# EAGLE design MineralFire-0.4-OLED-inprogress (EAGLE 9.1.3)

## Sheet 1 of 3: Main function
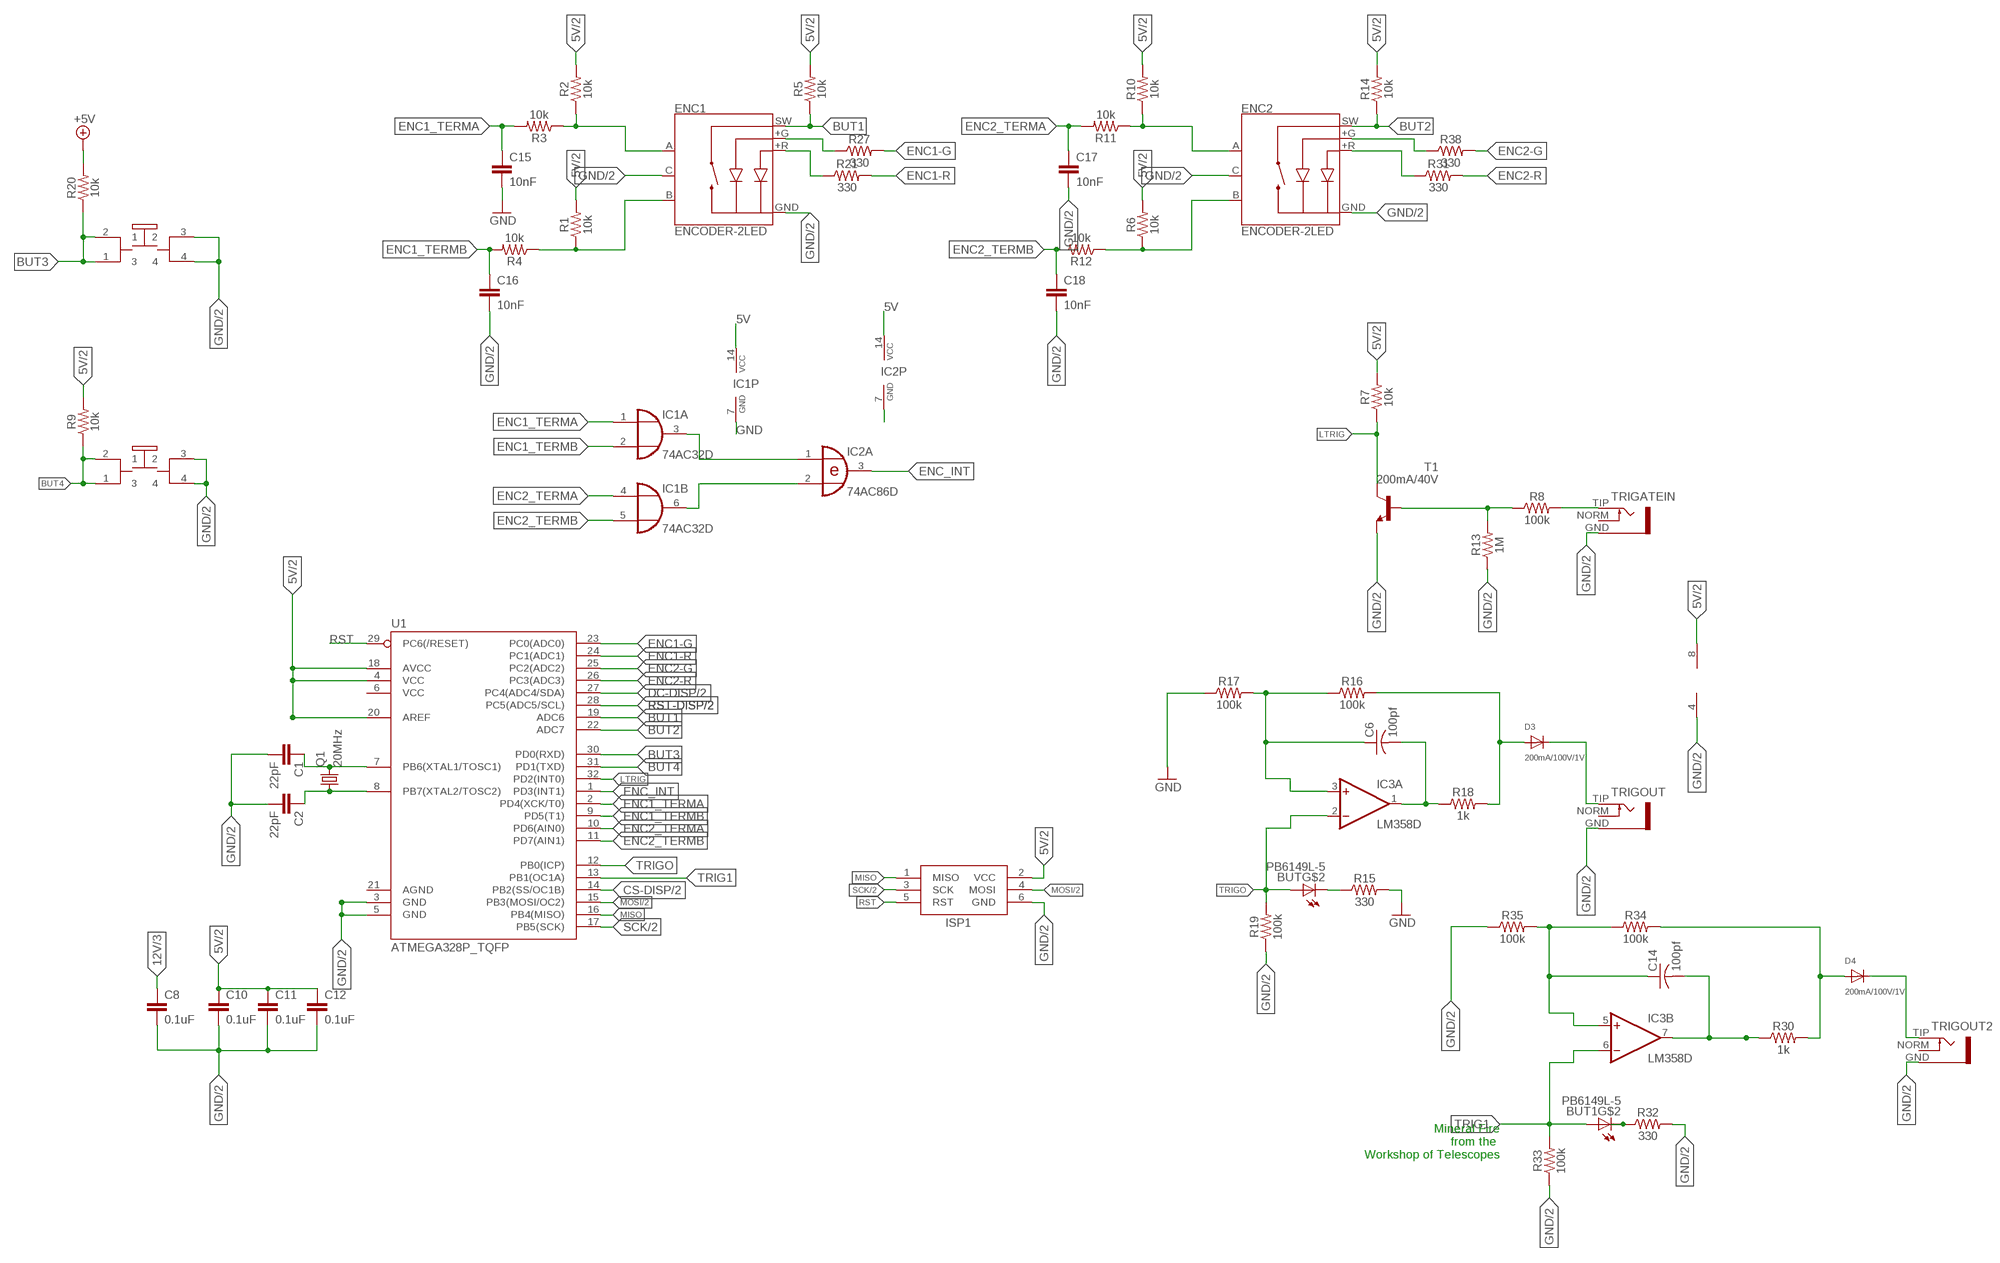
[diagram p0: schematic, sheet 1]

### Parts
BUT  PB6149L-5  [PB6149L]
BUT1  PB6149L-5  [PB6149L]
C1  22pF  22PF-0603-50V-5%  [0603]
C2  22pF  22PF-0603-50V-5%  [0603]
C6  100pf  C-USC0805K  [C0805K]
C8  0.1uF  0.1UF-0603-100V-10%  [0603]
C10  0.1uF  0.1UF-0603-100V-10%  [0603]
C11  0.1uF  0.1UF-0603-100V-10%  [0603]
C12  0.1uF  0.1UF-0603-100V-10%  [0603]
C14  100pf  C-USC0805K  [C0805K]
C15  10nF  10NF-0603-50V-10%  [0603]
C16  10nF  10NF-0603-50V-10%  [0603]
C17  10nF  10NF-0603-50V-10%  [0603]
C18  10nF  10NF-0603-50V-10%  [0603]
D3  200mA/100V/1V  DIODESMA  [SMADIODE]
D4  200mA/100V/1V  DIODESMA  [SMADIODE]
ENC1  ENCODER-2LED  [ENCODER_LED_2]
ENC2  ENCODER-2LED  [ENCODER_LED_2]
IC1  74AC32D  [SO14]
IC2  74AC86D  [SO14]
IC3  LM358D  [SO08]
ISP1  AVRISP-6  [AVRISP]
Q1  20MHz  CRYSTALHC49UP  [HC49UP]
R1  10k  10KOHM-0603-1/10W-1%  [0603]
R2  10k  10KOHM-0603-1/10W-1%  [0603]
R3  10k  10KOHM-0603-1/10W-1%  [0603]
R4  10k  10KOHM-0603-1/10W-1%  [0603]
R5  10k  10KOHM-0603-1/10W-1%  [0603]
R6  10k  10KOHM-0603-1/10W-1%  [0603]
R7  10k  10KOHM-0603-1/10W-1%  [0603]
R8  100k  100KOHM-0603-1/10W-1%  [0603]
R9  10k  10KOHM-0603-1/10W-1%  [0603]
R10  10k  10KOHM-0603-1/10W-1%  [0603]
R11  10k  10KOHM-0603-1/10W-1%  [0603]
R12  10k  10KOHM-0603-1/10W-1%  [0603]
R13  1M  1MOHM-0603-1/4W-5%  [0603]
R14  10k  10KOHM-0603-1/10W-1%  [0603]
R15  330  330OHM-0603-1/10W-1%  [0603]
R16  100k  100KOHM-0603-1/10W-1%  [0603]
R17  100k  100KOHM-0603-1/10W-1%  [0603]
R18  1k  1KOHM-0603-1/10W-1%  [0603]
R19  100k  100KOHM-0603-1/10W-1%  [0603]
R20  10k  10KOHM-0603-1/10W-1%  [0603]
R21  330  330OHM-0603-1/10W-1%  [0603]
R27  330  330OHM-0603-1/10W-1%  [0603]
R30  1k  1KOHM-0603-1/10W-1%  [0603]
R31  330  330OHM-0603-1/10W-1%  [0603]
R32  330  330OHM-0603-1/10W-1%  [0603]
R33  100k  100KOHM-0603-1/10W-1%  [0603]
R34  100k  100KOHM-0603-1/10W-1%  [0603]
R35  100k  100KOHM-0603-1/10W-1%  [0603]
R38  330  330OHM-0603-1/10W-1%  [0603]
T1  200mA/40V  MMBT3904LT1-NPN-SOT23-BEC  [SOT23-BEC]
TRIGATEIN  S_JACK  [S_JACK]
TRIGOUT  S_JACK  [S_JACK]
TRIGOUT2  S_JACK  [S_JACK]
U1  ATMEGA328P_TQFP  [TQFP32-08]

### Nets
5V: C10.1 C11.1 C12.1 IC1.14(P:VCC) IC2.14(P:VCC) IC3.8(P:V+) ISP1.2(VCC) R1.2 R2.2 R5.2 R6.2 R7.2 R9.2 R10.2 R14.2 U1.4(VCC) U1.18(AVCC) U1.20(AREF) ; also sheet 2,3
12V [12V]: C8.1 ; also sheet 3
+5V [Power]: R20.2
BUT1 [Power]: ENC1.SW R5.1 U1.19(ADC6)
BUT2 [Power]: ENC2.SW R14.1 U1.22(ADC7)
BUT3: BUT1.1 BUT1.2 R20.1 U1.30(PD0(RXD))
BUT4: BUT.1 BUT.2 R9.1 U1.31(PD1(TXD))
CS-DISP: U1.14(PB2(SS/OC1B)) ; also sheet 2
DC-DISP: U1.27(PC4(ADC4/SDA)) ; also sheet 2
ENC1-G: R27.2 U1.23(PC0(ADC0))
ENC1-R: R21.2 U1.24(PC1(ADC1))
ENC1_TERMA: C15.1 IC1.1(A:I0) R3.2 U1.2(PD4(XCK/T0))
ENC1_TERMB: C16.1 IC1.2(A:I1) R4.2 U1.9(PD5(T1))
ENC2-G: R38.2 U1.25(PC2(ADC2))
ENC2-R: R31.2 U1.26(PC3(ADC3))
ENC2_TERMA: C17.1 IC1.4(B:I0) R11.2 U1.10(PD6(AIN0))
ENC2_TERMB: C18.1 IC1.5(B:I1) R12.2 U1.11(PD7(AIN1))
ENC_INT: IC2.3(A:O) U1.1(PD3(INT1))
GND [Power]: BUT1.3 BUT1.4 BUT.3 BUT.4 C1.2 C2.2 C8.2 C10.2 C11.2 C12.2 C15.2 C16.2 C17.2 C18.2 ENC1.C ENC1.GND(-) ENC2.C ENC2.GND(-) IC1.7(P:GND) IC2.7(P:GND) IC3.4(P:V-) ISP1.6(GND) R13.1 R15.2 R17.1 R19.1 R32.2 R33.1 R35.1 T1.E TRIGATEIN.GND TRIGOUT2.GND TRIGOUT.GND U1.3(GND) U1.5(GND) ; also sheet 2,3
LTRIG: R7.1 T1.C U1.32(PD2(INT0))
MISO: ISP1.1(MISO) U1.16(PB4(MISO))
MOSI: ISP1.4(MOSI) U1.15(PB3(MOSI/OC2)) ; also sheet 2
N$1: C1.1 Q1.2 U1.7(PB6(XTAL1/TOSC1))
N$2: C2.1 Q1.1 U1.8(PB7(XTAL2/TOSC2))
N$3: ENC1.+R R21.1
N$4: IC1.3(A:O) IC2.1(A:I0)
N$5: IC1.6(B:O) IC2.2(A:I1)
N$6: ENC1.A R2.1 R3.1
N$12: ENC1.B R1.1 R4.1
N$15: R8.1 R13.2 T1.B
N$18: R8.2 TRIGATEIN.TIP
N$19: C14.2 IC3.7(B:OUT) R30.1
N$21: BUT1.K(C) R32.1
N$22: D4.A R30.2 R34.2
N$23: D4.C TRIGOUT2.TIP
N$24: C14.1 IC3.5(B:+IN) R34.1 R35.2
N$27: ENC2.A R10.1 R11.1
N$28: ENC2.B R6.1 R12.1
N$30: ENC1.+G R27.1
N$31: BUT.K(C) R15.1
N$32: C6.1 IC3.3(A:+IN) R16.1 R17.2
N$33: C6.2 IC3.1(A:OUT) R18.1
N$34: D3.A R16.2 R18.2
N$35: ENC2.+G R38.1
N$36: ENC2.+R R31.1
N$74: D3.C TRIGOUT.TIP
RST: ISP1.5(RST) U1.29(PC6(/RESET))
RST-DISP: U1.28(PC5(ADC5/SCL)) ; also sheet 2
SCK: ISP1.3(SCK) U1.17(PB5(SCK)) ; also sheet 2
TRIG1: BUT1.A IC3.6(B:-IN) R33.2 U1.13(PB1(OC1A))
TRIGO: BUT.A IC3.2(A:-IN) R19.2 U1.12(PB0(ICP))
Unconnected: IC1.8(C:O) IC1.9(C:I0) IC1.10(C:I1) IC1.11(D:O) IC1.12(D:I0) IC1.13(D:I1) IC2.4(B:I0) IC2.5(B:I1) IC2.6(B:O) IC2.8(C:O) IC2.9(C:I0) IC2.10(C:I1) IC2.11(D:O) IC2.12(D:I0) IC2.13(D:I1) TRIGATEIN.NORM TRIGOUT2.NORM TRIGOUT.NORM U1.6(VCC) U1.21(AGND)

### Notes on the sheet
- Mineral Fire
  from the 
  Workshop of Telescopes

## Sheet 2 of 3: Display
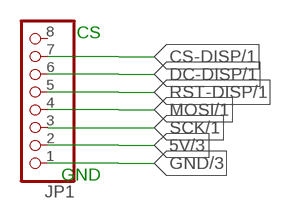
[diagram p1: schematic, sheet 2]

### Parts
JP1  MICROBUILDER_HEADER-1X8ROUND  [MICROBUILDER_1X08_ROUND]

### Nets
5V: JP1.2 ; also sheet 1,3
CS-DISP: JP1.7 ; also sheet 1
DC-DISP: JP1.6 ; also sheet 1
GND [Power]: JP1.1 ; also sheet 1,3
MOSI: JP1.4 ; also sheet 1
RST-DISP: JP1.5 ; also sheet 1
SCK: JP1.3 ; also sheet 1
Unconnected: JP1.8

### Notes on the sheet
- CS
- GND

## Sheet 3 of 3: Power
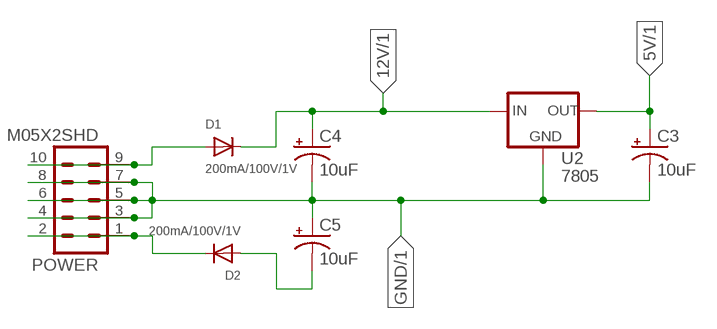
[diagram p2: schematic, sheet 3]

### Parts
C3  10uF  CPOL-US153CLV-0505  [153CLV-0505]
C4  10uF  CPOL-US153CLV-0505  [153CLV-0505]
C5  10uF  CPOL-US153CLV-0505  [153CLV-0505]
D1  200mA/100V/1V  DIODESMA  [SMADIODE]
D2  200mA/100V/1V  DIODESMA  [SMADIODE]
POWER  M05X2SHD  [2X5-SHROUDED]
U2  7805  V-REG  [V-REG]

### Nets
5V: C3.+ U2.3(OUT) ; also sheet 1,2
12V [12V]: C4.+ D1.C U2.1(IN) ; also sheet 1
GND [Power]: C3.- C4.- C5.+ POWER.3 POWER.4 POWER.5 POWER.6 POWER.7 POWER.8 U2.4(GND) ; also sheet 1,2
N$9: D1.A POWER.9 POWER.10
N$10: D2.C POWER.1 POWER.2
N$38 [Power]: C5.- D2.A

## Library data of the parts
BUT BUT1 = INSTRUO:PB6149L-5
C1 C2 = SparkFun-Capacitors:22PF: 22pF ceramic capacitors A capacitor is a passive two-terminal electrical component used to store electrical energy temporarily in an electric field.; PROD_ID: CAP-07876
C3-C5 = rcl:CPOL-US: POLARIZED CAPACITOR, American symbol; SPICEPREFIX: C
C6 C14 = rcl:C-US: CAPACITOR, American symbol; SPICEPREFIX: C
C8 C10-C12 = SparkFun-Capacitors:0.1UF: 0.1µF ceramic capacitors A capacitor is a passive two-terminal electrical component used to store electrical energy temporarily in an electric field.; PROD_ID: CAP-08390
C15-C18 = SparkFun-Capacitors:10NF: 0.01uF/10nF/10,000pF ceramic capacitors A capacitor is a passive two-terminal electrical component used to store electrical energy temporarily in an electric field. CAP-09321; PROD_ID: CAP-00867
D1-D4 = adafruit:DIODE: Diode SMADIODE - SMA Surface Mount Package 20V 1A Schottky Diode Digikey: 641-1014-6-ND DO-1N4148 - Through Hole Small Current Diode SOD-123 20V 1 A (.5mV Vf) Schottky Diode - Digikey: MBRX120TPMSCT-ND SOD-323 10V 570mA (.38mV Vf, 3ns) Schottky Diode - Digikey: ZLLS410CT-ND SOD-523 30V 30mA Schottky Diode (RB751S-40TE61) - Digikey: RB751S-40TE61CT-ND SOT23-R/W - SOT23 Package (R = Solder Paste/Reflow Ovens, W = Hand-Soldering) BAT54Film 40V 300mA - Digikey: 497-7162-1-ND
ENC1 ENC2 = SparkFun-Switches:ENCODER-2LED: Illuminated Rotary Encoder w/ 2 LEDs Rotary encoders rotate similarly to potentiometers, but they’re different from potentiometers in that an encoder has full rotation without limits. They output gray code so that you can tell how much and in which direction the encoder has been turned. This encoder has a red/green LED built-in, which shines through the encoder shaft. SparkFun Products Rotary Encoder - Illuminated (Red/Green) <https://www.sparkfun.com/products/10596> (COM-10596) SparkFun Rotary Encoder Breakout - Illuminated (RG/RGB) <https://www.sparkfun.com/products/11722> (BOB-11722); PROD_ID: COMP-11113; SF_SKU: COM-10596
IC1 = 74xx-eu:74*32: Quad 2-input OR gate
IC2 = 74xx-eu:74*86: Quad 2-input EXCLUSIVE-OR (XOR) gate
IC3 = linear:LM358: OP AMP also LM158; LM258; LM2904 Source: http://cache.national.com/ds/LM/LM158.pdf
ISP1 = adafruit:AVRISP: AVR ISP HEADER Standard 6 pin header for AVR programming
JP1 = Adafruit_1.3_128x64_OLED:MICROBUILDER_HEADER-1X8: PIN HEADER
POWER = SparkFun-Connectors:M05X2: Header 5x2 Standard 10-pin dual row 0.1" header. Commonly used with AVR-ISP. Use with Spark Fun Electronics SKU: PRT-00778
Q1 = adafruit:CRYSTAL: CRYSTAL; OC_FARNELL: unknown; OC_NEWARK: unknown
R1-R7 R9-R12 R14 R20 = SparkFun-Resistors:10KOHM: 10kΩ resistor A resistor is a passive two-terminal electrical component that implements electrical resistance as a circuit element. Resistors act to reduce current flow, and, at the same time, act to lower voltage levels within circuits. - Wikipedia; PROD_ID: RES-00824
R8 R16 R17 R19 R33-R35 = SparkFun-Resistors:100KOHM: 100kΩ resistor A resistor is a passive two-terminal electrical component that implements electrical resistance as a circuit element. Resistors act to reduce current flow, and, at the same time, act to lower voltage levels within circuits. - Wikipedia; PROD_ID: RES-07828
R13 = SparkFun-Resistors:1MOHM: 1MΩ resistor A resistor is a passive two-terminal electrical component that implements electrical resistance as a circuit element. Resistors act to reduce current flow, and, at the same time, act to lower voltage levels within circuits. - Wikipedia; PROD_ID: RES-07868
R15 R21 R27 R31 R32 R38 = SparkFun-Resistors:330OHM: 330Ω resistor A resistor is a passive two-terminal electrical component that implements electrical resistance as a circuit element. Resistors act to reduce current flow, and, at the same time, act to lower voltage levels within circuits. - Wikipedia; PROD_ID: RES-00818
R18 R30 = SparkFun-Resistors:1KOHM: 1kΩ resistor A resistor is a passive two-terminal electrical component that implements electrical resistance as a circuit element. Resistors act to reduce current flow, and, at the same time, act to lower voltage levels within circuits. - Wikipedia; PROD_ID: RES-07856
T1 = transistor:*-NPN-: NPN Transistror BF959 corrected 2008.03.06
TRIGATEIN TRIGOUT TRIGOUT2 = INSTRUO:S_JACK
U1 = SparkFun-IC-Microcontroller:ATMEGA328P_TQFP: Popular 328P in QFP Storefront component: ATmega328 - TQFP <https://www.sparkfun.com/products/13448> (COM-13448) Datasheet <http://www.sparkfun.com/datasheets/Components/SMD/ATMega328.pdf> SparkFun Products SparkFun RedBoard - Programmed with Arduino <https://www.sparkfun.com/products/12757> (DEV-12757) Arduino Pro Mini 328 - 5V/16MHz <https://www.sparkfun.com/products/11113> (DEV-11113) Arduino Pro Mini 328 - 3.3V/8MHz <https://www.sparkfun.com/products/11114> (DEV-11114) SparkFun OpenLog <https://www.sparkfun.com/products/13712> (DEV-13712) SparkFun MicroView - OLED Arduino Module <https://www.sparkfun.com/products/12923> (DEV-12923) SparkFun Digital Sandbox <https://www.sparkfun.com/products/12651> (DEV-12651) SparkFun PicoBoard <https://www.sparkfun.com/products/11888> (WIG-11888) Arduino Fio <https://www.sparkfun.com/products/10116> (DEV-10116) LilyPad Arduino 328 Main Board <https://www.sparkfun.com/products/13342> (DEV-13342) SparkFun RedStick <https://www.sparkfun.com/products/13741> (DEV-13741) LilyPad MP3 <https://www.sparkfun.com/products/11013> (DEV-11013) LilyPad Arduino SimpleSnap <https://www.sparkfun.com/products/10941> (DEV-10941) SparkFun Stepoko <https://www.sparkfun.com/products/13899> (ROB-13899) SparkFun Geiger Counter <https://www.sparkfun.com/products/11345> (SEN-11345) SparkFun EL Sequencer <https://www.sparkfun.com/products/12781> (COM-12781) Arduino Pro 328 - 5V/16MHz <https://www.sparkfun.com/products/10915> (DEV-10915) CryptoCape <https://www.sparkfun.com/products/12773> (DEV-12773) SparkFun IR Thermometer Evaluation Board - MLX90614 <https://www.sparkfun.com/products/10740> (SEN-10740) SparkFun RedBot Mainboard <https://www.sparkfun.com/products/12097> (ROB-12097) Arduino Pro 328 - 3.3V/8MHz <https://www.sparkfun.com/products/10914> (DEV-10914) SparkFun Block for Intel® Edison - Arduino <https://www.sparkfun.com/products/13036> (DEV-13036) SparkFun Simon Says - Surface Mount Soldering Kit <https://www.sparkfun.com/products/10935> (KIT-10935) SparkFun 7-Segment Serial Display - Red <https://www.sparkfun.com/products/11441> (COM-11441) SparkFun 7-Segment Serial Display - White <https://www.sparkfun.com/products/11629> (COM-11629) SparkFun 7-Segment Serial Display - Yellow <https://www.sparkfun.com/products/11443> (COM-11443) SparkFun 7-Segment Serial Display - Kelly Green <https://www.sparkfun.com/products/11440> (COM-11440) SparkFun 7-Segment Serial Display - Blue <https://www.sparkfun.com/products/11442> (COM-11442) SparkFun OpenSegment Serial Display - 20mm (Blue) <https://www.sparkfun.com/products/11647> (COM-11647) SparkFun OpenSegment Serial Display - 20mm (Green) <https://www.sparkfun.com/products/11646> (COM-11646) SparkFun OpenSegment Serial Display - 20mm (White) <https://www.sparkfun.com/products/11648> (COM-11648) SparkFun OpenSegment Serial Display - 20mm (Red) <https://www.sparkfun.com/products/11644> (COM-11644) SparkFun OpenSegment Serial Display - 20mm (Yellow) <https://www.sparkfun.com/products/11645> (COM-11645) SparkFun OpenSegment Shield <https://www.sparkfun.com/products/13190> (DEV-13190); PROD_ID: IC-09069
U2 = INSTRUO:V-REG

## Net classes
1 Power: width 0.35 mm
2 12V: width 0.6 mm

## Board
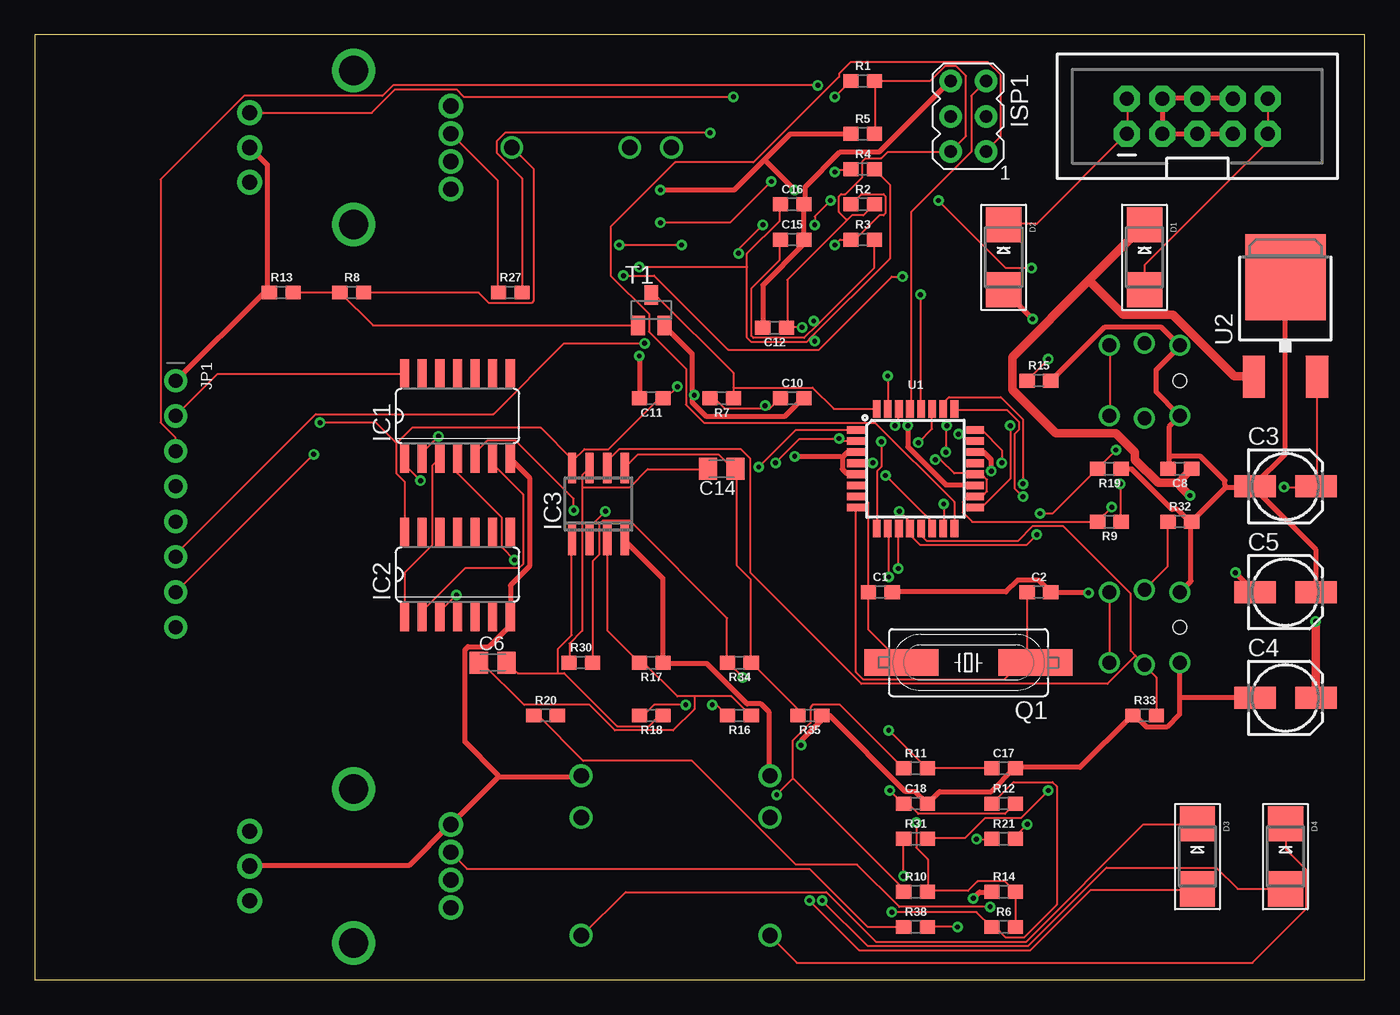
[diagram p3: board, top side]
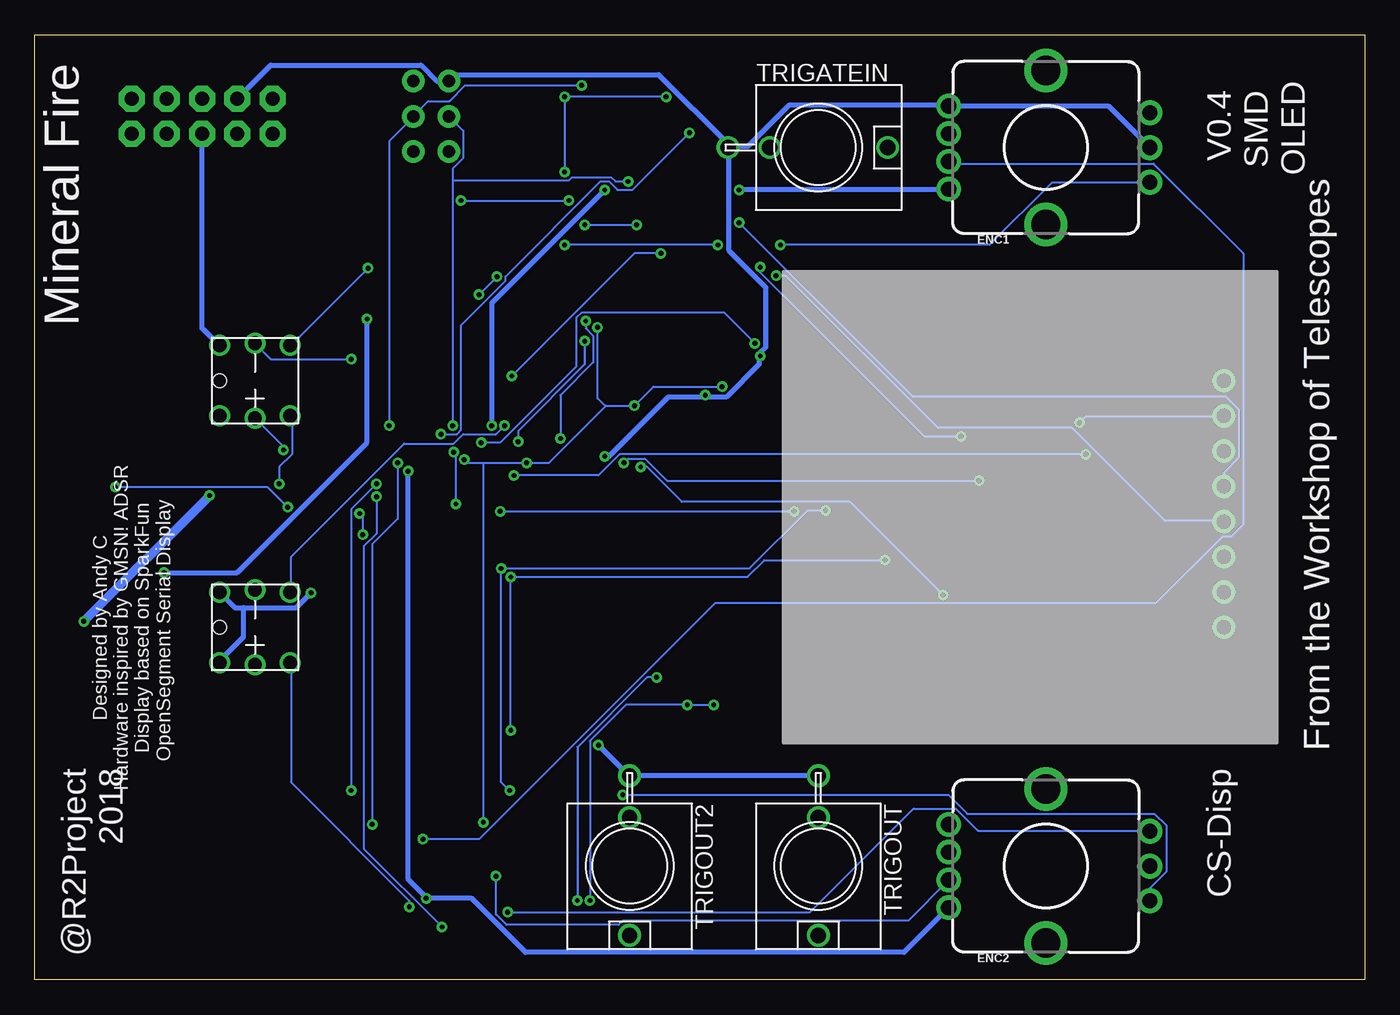
[diagram p4: board, bottom side, seen from below]

Size 95.89 x 68.11 mm. Coordinates in mm from the lower left corner, seen from the top.
Outline: 0,0 95.89,0 95.89,68.11 0,68.11 0,0
Copper layers (1*16): Top 0.035mm / dielectric 1.5mm / Bottom 0.035mm
Design rules "default": minimum track width 6mil, minimum drill 0.35mm, track to track 6mil, track to pad 6mil, pad to pad 6mil, via to via 6mil, smd to smd 6mil, copper to edge 40mil, drill to drill 6mil, minimum pad ring 10mil, minimum via ring 8mil, stop-mask expansion 4mil, vias tented up to drill 0mil, thermal gap 10mil

### Footprints (pad centres in the part's own frame; a part is rotated, then mirrored left to right if it is on the bottom)
PB6149L = drill 1: 1 2.54,-2.54; 2 2.54,2.54; 3 -2.54,-2.54; 4 -2.54,2.54; A 0,-2.7; K 0,2.7 | hole 1: -2.54,0
0603 = smd 1.1 x 1: 1 -0.85,0; 2 0.85,0
153CLV-0505 = smd 3 x 1.6: + 2.2,0; - -2.2,0
C0805K = smd 1.3 x 1.6: 1 -1,0; 2 1,0
SMADIODE = smd 2.54 x 2.54: A 2.349,0; C -2.349,0
ENCODER_LED_2 = drill 1.1 pad 1.778: +G 1,7; +R -1,7; GND 3,7; SW -3,7 | drill 1.1 pad 1.8: A -2.5,-7.5; B 2.5,-7.5; C 0,-7.5 | drill 2.1: P$1 -5.55,0; P$2 5.55,0
SO14 = smd 0.66 x 2.032: 1 -3.81,-3.073; 2 -2.54,-3.073; 3 -1.27,-3.073; 4 0,-3.073; 5 1.27,-3.073; 6 2.54,-3.073; 7 3.81,-3.073; 8 3.81,3.073; 9 2.54,3.073; 10 1.27,3.073; 11 0,3.073; 12 -1.27,3.073; 13 -2.54,3.073; 14 -3.81,3.073
SO08 = smd 0.6 x 2.2: 1 -1.905,-2.6; 2 -0.635,-2.6; 3 0.635,-2.6; 4 1.905,-2.6; 5 1.905,2.6; 6 0.635,2.6; 7 -0.635,2.6; 8 -1.905,2.6
AVRISP = drill 0.9 pad 1.626: 1 -1.27,2.54; 2 1.27,2.54; 3 -1.27,0; 4 1.27,0; 5 -1.27,-2.54; 6 1.27,-2.54
MICROBUILDER_1X08_ROUND = drill 1 pad 1.676: 1 -8.89,0; 2 -6.35,0; 3 -3.81,0; 4 -1.27,0; 5 1.27,0; 6 3.81,0; 7 6.35,0; 8 8.89,0
2X5-SHROUDED = drill 1.016 pad 1.88 octagon: 1 -1.27,5.08; 2 1.27,5.08; 3 -1.27,2.54; 4 1.27,2.54; 5 -1.27,0; 6 1.27,0; 7 -1.27,-2.54; 8 1.27,-2.54; 9 -1.27,-5.08; 10 1.27,-5.08
HC49UP = smd 5.334 x 1.93: 1 -4.826,0; 2 4.826,0
SOT23-BEC = smd 1 x 1.4: B -0.95,-1.1; C 0,1.1; E 0.95,-1.1
S_JACK = drill 1.1: GND 0,-6.5; NORM 0,-3.5; TIP 0,5
TQFP32-08 = smd 1.27 x 0.559: 1 -4.293,2.8; 2 -4.293,2; 3 -4.293,1.2; 4 -4.293,0.4; 5 -4.293,-0.4; 6 -4.293,-1.2; 7 -4.293,-2; 8 -4.293,-2.8; 17 4.293,-2.8; 18 4.293,-2; 19 4.293,-1.2; 20 4.293,-0.4; 21 4.293,0.4; 22 4.293,1.2; 23 4.293,2; 24 4.293,2.8 | smd 0.559 x 1.27: 9 -2.8,-4.293; 10 -2,-4.293; 11 -1.2,-4.293; 12 -0.4,-4.293; 13 0.4,-4.293; 14 1.2,-4.293; 15 2,-4.293; 16 2.8,-4.293; 25 2.8,4.293; 26 2,4.293; 27 1.2,4.293; 28 0.4,4.293; 29 -0.4,4.293; 30 -1.2,4.293; 31 -2,4.293; 32 -2.8,4.293
V-REG = smd 1.6 x 3: 1 -2.28,-4.8; 3 2.28,-4.8 | smd 5.8 x 6.2: 4 0,2.38

### Placement (x,y rotation side)
BUT  80.01,43.18 0 bottom
BUT1  80.01,25.4 0 bottom
C1  60.96,27.94 0 top
C2  72.39,27.94 0 top
C3  90.17,35.56 0 top
C4  90.17,20.32 0 top
C5  90.17,27.94 0 top
C6  33.02,22.86 0 top
C8  82.55,36.83 180 top
C10  54.61,41.91 0 top
C11  44.45,41.91 180 top
C12  53.34,46.99 180 top
C14  49.53,36.83 180 top
C15  54.61,53.34 0 top
C16  54.61,55.88 0 top
C17  69.85,15.24 0 top
C18  63.5,12.7 0 top
D1  80.01,52.07 270 top
D2  69.85,52.07 270 top
D3  83.82,8.89 270 top
D4  90.17,8.89 270 top
ENC1  23,59.98 90 bottom
ENC2  23,8.2 90 bottom
IC1  30.48,40.64 0 top
IC2  30.48,29.21 0 top
IC3  40.64,34.29 0 top
ISP1  67.31,62.23 180 top
JP1  10.16,34.29 270 top
POWER  83.82,62.23 90 top
Q1  67.31,22.86 180 top
R1  59.69,64.77 0 top
R2  59.69,55.88 0 top
R3  59.69,53.34 0 top
R4  59.69,58.42 0 top
R5  59.69,60.96 0 top
R6  69.85,3.81 0 top
R7  49.53,41.91 180 top
R8  22.86,49.53 0 top
R9  77.47,33.02 180 top
R10  63.5,6.35 0 top
R11  63.5,15.24 0 top
R12  69.85,12.7 0 top
R13  17.78,49.53 0 top
R14  69.85,6.35 0 top
R15  72.39,43.18 0 top
R16  50.8,19.05 180 top
R17  44.45,22.86 180 top
R18  44.45,19.05 180 top
R19  77.47,36.83 180 top
R20  36.83,19.05 0 top
R21  69.85,10.16 0 top
R27  34.29,49.53 0 top
R30  39.37,22.86 0 top
R31  63.5,10.16 0 top
R32  82.55,33.02 0 top
R33  80.01,19.05 0 top
R34  50.8,22.86 180 top
R35  55.88,19.05 180 top
R38  63.5,3.81 0 top
T1  44.45,48.26 0 top
TRIGATEIN  39.4,59.98 270 bottom
TRIGOUT  39.4,8.2 180 bottom
TRIGOUT2  53,8.2 180 bottom
U1  63.5,36.83 0 top
U2  90.17,48.26 0 top

### Tracks (layer width: path | path; a pad name or v marks a point on that pad's centre or on a via)
5V  (via drill 0.35)
  Top 0.152: IC1.14 26.67,43.66 13.18,43.66 10.21,40.69 JP1.2 | 26.1,38.67 27.2,39.78 36.5,39.78 38.79,37.49 IC3.8 38.79,36.96 38.79,37.41 39.62,38.25 41.38,38.25 45.03,41.91 45.26,41.91 C11.1 45.34,41.91 45.49,41.91 v46.33,42.75 | 26.1,38.67 26.06,38.63 26.06,36.5 26.67,35.89 26.67,32.31 IC2.14 | v20.57,40.16 24.61,40.16 26.06,38.71 26.1,38.67 | 60.58,64.77 60.58,60.96 R5.2 | 60.58,64.77 R1.2 60.58,64.77 | 60.58,64.77 64.54,64.77 65.61,65.84 66.45,65.84 67.13,65.15 67.13,60.81 66.06,59.74 ISP1.2 65.99,59.66 61.49,59.66 61.04,59.21 59.89,59.21 59.66,58.98 59.66,57.84 58.45,56.62 58.14,56.62 57.99,56.46 57.99,55.32 58.52,54.79 58.56,54.75 | 58.56,54.75 58.9,55.09 59.74,55.09 60.5,55.85 R2.2 | 58.56,54.75 54.25,50.44 54.25,47.02 C12.1 54.33,47.02 v55.32,47.02 | U2.3 92.43,43.43 92.43,35.59 C3.+ 92.35,35.51 v90.07,35.51 | R6.2 70.71,3.81 70.71,6.33 R14.2 70.64,6.4 69.95,7.09 67.97,7.09 67.28,6.4 64.39,6.4 R10.2 64.39,6.48 64.39,8.69 63.55,9.53 v63.55,11.35 | 52.65,41.15 52.96,41.15 53.72,41.91 C10.1 | 52.65,41.15 49.76,41.15 49,41.91 48.69,41.91 R7.2 | v60.43,37.26 59.21,37.26 U1.4 | v64.92,37.49 65.3,37.49 66.29,36.5 67.74,36.5 U1.20 67.82,36.42 68.28,36.42 68.66,36.04 68.66,35.2 68.35,34.9 67.82,34.9 U1.18 67.74,34.82 67.28,34.82 66.9,34.44 66.9,33.68 67.59,32.99 76.58,32.99 R9.2 76.66,33.07 v77.65,34.06 | v52.65,41.38 52.65,41.15
  Bottom 0.152: v20.57,40.16 20.12,40.62 10.21,40.62 JP1.2 | 63.55,37.26 64.69,37.26 v64.92,37.49 | 63.55,37.26 v60.43,37.26 58.83,37.26 54.75,41.34 | 54.75,41.34 54.71,41.38 v52.65,41.38 51.28,42.75 v46.33,42.75 | 63.55,37.26 v63.55,11.35 | v90.07,35.51 79.1,35.51 v77.65,34.06 | v55.32,47.02 55.32,41.91 54.79,41.38 54.75,41.34
12V  (via drill 0.35)
  Top 0.6: 82.45,35.81 82.75,36.12 82.75,36.2 83.36,36.8 C8.1 | 82.45,35.81 81,35.81 79.32,37.49 79.32,38.02 77.95,39.4 73.61,39.4 70.48,42.52 70.48,44.88 76.01,50.41 | 76.01,50.41 80.01,54.41 D1.C | v92.35,25.83 92.35,20.34 C4.+ | v83.29,34.9 82.6,35.59 82.45,35.81 | U2.1 87.86,43.51 86.49,43.51 82.07,47.93 78.49,47.93 76.2,50.22 76.01,50.41
  Bottom 0.6: v83.29,34.9 v92.35,25.83
BUT1  (via drill 0.35)
  Top 0.35: 52.62,59.09 50.44,56.92 v45.11,56.92 | 52.62,59.09 54.48,60.96 58.83,60.96 R5.1 | v62.94,39.93 62.94,38.41 65.68,35.66 67.74,35.66 U1.19 | v54.79,56.92 52.73,58.98 52.62,59.09
  Bottom 0.35: v45.11,56.92 30.02,56.92 ENC1.SW | v62.94,39.93 62.94,48.77 v54.79,56.92
BUT2  (via drill 0.35)
  Top 0.35: v67.67,5.87 68.12,6.33 68.96,6.33 R14.1 | v68.96,36.65 68.96,37.49 68.43,38.02 67.82,38.02 U1.22
  Bottom 0.35: ENC2.SW 30.02,5.18 33.22,1.98 60.5,1.98 64.39,5.87 v67.67,5.87 67.74,6.02 68.96,7.24 v68.96,36.65
BUT3  (via drill 0.35)
  Top 0.152: v62.03,39.93 62.26,40.16 62.26,41.07 U1.30 | v68.89,5.26 62.33,5.26 59.28,8.31 54.86,8.31 47.4,15.77 39.55,15.77 36.27,19.05 36.04,19.05 R20.1 | BUT1.2 77.5,27.89 77.5,22.86 BUT1.1
  Bottom 0.152: v62.03,39.93 62.64,39.32 65,39.32 65.68,38.63 69.27,38.63 77.42,30.48 77.42,27.96 BUT1.2 | v68.89,5.26 68.89,5.71 77.42,14.25 77.42,22.86 BUT1.1
BUT4  (via drill 0.35)
  Top 0.152: v78.26,35.74 78.26,33.07 R9.1 | v61.49,43.51 61.49,41.15 U1.31 | v50.75,52.35 50.75,52.65 v52.5,54.41 | v56.24,54.41 56.24,55.02 v57.38,56.16 | v65.15,56.16 70.03,51.28 v71.86,51.28 | BUT.1 77.5,40.69 77.5,45.72 BUT.2
  Bottom 0.152: v78.26,35.74 78.26,36.96 77.34,37.87 77.34,40.54 77.42,40.62 BUT.1 | v61.49,43.51 52.65,52.35 v50.75,52.35 | v56.24,54.41 v52.5,54.41 | v65.15,56.16 v57.38,56.16 | v71.86,51.28 77.42,45.72 BUT.2
CS-DISP  (via drill 0.35)
  Top 0.152: v61.34,36.35 64.69,32.99 U1.14 | v20.12,37.87 10.21,27.96 JP1.7
  Bottom 0.152: v61.34,36.35 55.24,36.35 53.72,37.87 v20.12,37.87
DC-DISP  (via drill 0.35)
  Top 0.152: v63.7,38.71 64.69,39.7 64.69,41.07 U1.27 | v43.97,45.87 38.18,45.87 33.07,40.77 20.27,40.77 10.21,30.71 10.21,30.48 JP1.6
  Bottom 0.152: v63.7,38.71 62.33,38.71 56.84,44.2 56.84,47.7 56.46,48.08 46.18,48.08 v43.97,45.87
ENC1-G  (via drill 0.35)
  Top 0.152: v48.69,61.04 33.91,61.04 33.3,60.43 33.3,59.59 35.13,57.76 35.13,49.53 R27.2 | v66.6,39.32 66.83,39.32 67.28,38.86 67.74,38.86 U1.23
  Bottom 0.152: v48.69,61.04 52.81,56.92 53.87,56.92 54.48,57.53 55.09,57.53 61.95,50.67 61.95,50.37 65.15,47.17 65.15,39.62 65.46,39.32 v66.6,39.32
ENC1-R  (via drill 0.35)
  Top 0.152: v71.55,11.2 70.71,10.36 70.71,10.21 R21.2 | v69.72,37.26 69.72,38.18 68.28,39.62 67.82,39.62 U1.24
  Bottom 0.152: v71.55,11.2 71.55,31.39 69.72,33.22 v69.72,37.26
ENC1_TERMA  (via drill 0.35)
  Top 0.152: 56.43,47.21 60.5,51.28 60.5,53.34 R3.2 | 56.43,47.21 55.47,46.25 51.82,46.25 51.66,46.41 51.66,49.84 53.72,51.89 53.72,53.34 C15.1 | v56.16,47.47 56.39,47.24 56.43,47.21 | U1.2 59.21,38.86 58.14,38.86 v57.99,39.01 57.99,38.94 55.09,38.94 v53.42,37.26 | IC1.1 26.67,37.11 v27.81,35.97
  Bottom 0.152: v57.99,39.01 57.99,42.14 55.63,44.5 55.63,46.41 56.16,46.94 v56.16,47.47 | v27.81,35.97 50.29,35.97 51.89,37.57 53.11,37.57 v53.42,37.26
ENC1_TERMB  (via drill 0.35)
  Top 0.152: 51.36,51.36 51.36,46.25 51.66,45.95 55.63,45.95 55.97,46.29 | 51.36,51.36 51.36,52.35 53.72,54.71 53.72,55.85 C16.1 | 55.97,46.29 61.65,51.97 61.65,57.3 60.58,58.37 R4.2 | v61.04,38.79 61.04,36.96 60.73,36.65 60.73,32.54 U1.9 | v56.24,46.02 56.01,46.25 55.97,46.29 | v29.11,39.17 27.96,38.02 27.96,37.57 IC1.2 | 51.36,51.36 v43.59,51.36
  Bottom 0.152: v61.04,38.79 61.04,39.55 56.24,44.35 v56.24,46.02 | v29.11,39.17 31.77,39.17 43.59,50.98 v43.59,51.36
ENC2-G  (via drill 0.35)
  Top 0.152: v66.52,3.81 64.39,3.81 R38.2 | v71.25,34.82 70.64,35.43 70.64,39.32 70.94,39.62 70.94,40.23 70.1,41.07 66.37,41.07 U1.25
  Bottom 0.152: v66.52,3.81 72.16,9.45 72.16,31.24 71.25,32.16 v71.25,34.82
ENC2-R  (via drill 0.35)
  Top 0.152: v73.08,13.64 71.09,11.66 68.5,11.66 67.06,10.21 64.39,10.21 R31.2 | v71.25,35.74 71.25,40.39 69.65,41.99 65.91,41.99 65.53,41.6 65.53,41.15 U1.26
  Bottom 0.152: v73.08,13.64 73.08,33.91 v71.25,35.74
ENC2_TERMA  (via drill 0.35)
  Top 0.152: C17.1 68.96,15.24 64.39,15.24 R11.2 64.31,15.24 v61.57,17.98 | v61.57,29.03 61.57,32.54 U1.10 | IC1.4 30.48,36.5 33.68,33.3 33.68,31.17 v34.59,30.25
  Bottom 0.152: v61.57,17.98 v61.57,29.03 44.5,29.03 43.28,30.25 v34.59,30.25
ENC2_TERMB  (via drill 0.35)
  Top 0.152: R12.2 70.64,12.65 69.95,11.96 63.7,11.96 63.02,12.65 62.71,12.65 C18.1 62.64,12.65 v61.65,13.64 | v62.26,29.64 62.26,32.54 U1.11 | v38.86,33.83 38.86,34.67 34.67,38.86 32.61,38.86 31.77,38.02 31.77,37.57 IC1.5
  Bottom 0.152: v61.65,13.64 62.26,14.25 v62.26,29.64 44.35,29.64 40.16,33.83 v38.86,33.83
ENC_INT  (via drill 0.35)
  Top 0.152: v52.2,36.96 54.86,39.62 U1.1 | v30.4,27.74 29.26,26.59 29.26,26.14 IC2.3
  Bottom 0.152: v52.2,36.96 51.74,36.96 49.23,34.44 37.11,34.44 v30.4,27.74
GND  (via drill 0.35)
  Top 0.35: 47.4,42.14 47.4,45.11 45.41,47.09 T1.E | 47.4,42.14 47.4,41.6 48.39,40.62 54.1,40.62 55.4,41.91 C10.2 | 58.22,37.64 58.22,36.8 58.52,36.5 59.21,36.5 U1.5 | 58.22,37.64 58.6,38.02 U1.3 | v43.59,44.96 43.59,41.91 C11.2 | v54.79,37.72 58.06,37.72 58.22,37.64 | v47.55,42.14 47.4,42.14 | JP1.1 10.21,43.2 16.54,49.53 16.92,49.53 R13.1 16.76,49.68 16.76,58.75 15.54,59.97 ENC1.C | IC1.7 35.66,36.2 35.66,29.79 34.29,28.42 IC2.7 34.21,25.98 34.21,25.45 32.77,24 31.24,24 31.01,23.77 31.01,17.14 33.38,14.78 33.45,14.63 | IC3.4 42.6,31.62 45.26,28.96 45.26,22.86 R17.1 45.41,22.78 48.46,22.78 51.36,19.89 52.35,19.89 52.96,19.28 52.96,14.71 TRIGOUT2.GND | 33.45,14.63 39.4,14.63 TRIGOUT.GND | 33.45,14.63 30.02,11.2 ENC2.GND 29.87,11.12 26.98,8.23 15.54,8.23 ENC2.C | C12.2 52.5,47.02 52.5,50.06 55.4,52.96 55.4,53.34 C15.2 55.47,53.49 55.47,55.85 C16.2 55.55,56.01 55.55,57.15 58.06,59.66 60.88,59.66 65.99,64.77 ISP1.6 | 82.53,20.34 82.53,22.86 BUT1.3 | 82.53,20.34 82.53,19.13 81.61,18.21 80.16,18.21 79.32,19.05 79.17,19.05 R33.1 79.02,18.97 75.36,15.32 70.87,15.32 C17.2 70.64,15.24 68.96,13.56 65.23,13.56 64.47,12.8 C18.2 64.31,12.72 63.48,13.56 62.79,13.56 57.3,19.05 56.77,19.05 R35.1 56.69,18.9 56.69,18.67 55.24,17.22 v55.24,16.92 | C4.- 87.94,20.34 82.68,20.34 82.53,20.34 | POWER.7 86.33,60.96 83.97,60.96 POWER.5 81.46,60.96 POWER.3 81.31,60.96 81.31,63.48 POWER.4 81.46,63.55 83.82,63.55 POWER.6 83.97,63.55 86.33,63.55 POWER.8 | R15.2 73.3,43.2 77.11,47.02 81.23,47.02 82.53,45.72 BUT.4 82.45,45.57 80.85,43.97 80.85,42.37 82.45,40.77 BUT.3 82.53,40.62 81.76,39.85 81.76,37.72
  Top 0.35: C1.2 61.87,27.96 70.03,27.96 70.87,28.8 72.39,28.8 73.23,27.96 C2.2 73.38,27.89 v75.97,27.89 | 81.76,37.72 81.76,36.88 C8.2 | R32.2 83.36,32.99 83.36,28.73 82.6,27.96 BUT1.4 | R19.1 78.33,36.8 79.1,36.8 81.99,33.91 82.37,33.91 83.21,33.07 R32.2 | 85.88,35.51 87.94,35.51 C3.- | 85.88,35.51 83.52,33.15 R32.2 | C5.+ 92.35,27.96 92.35,31.01 88.01,35.36 C3.- | 81.76,37.72 81.92,37.72 84.05,37.72 85.8,35.97 85.8,35.66 85.88,35.51 | U2.4 90.14,50.6 90.14,37.87 88.01,35.74 C3.-
  Bottom 0.35: TRIGATEIN.GND 45.87,59.97 45.87,52.58 43.2,49.91 43.2,45.57 43.59,45.19 v43.59,44.96 43.66,44.81 43.66,44.35 46.02,41.99 47.55,41.99 | v54.79,37.72 54.48,37.72 50.22,41.99 47.55,41.99 | v47.55,42.14 47.55,41.99 | ENC1.C 15.54,60.05 18.44,62.94 29.95,62.94 ENC1.GND 30.18,63.02 41.53,63.02 44.5,60.05 45.72,60.05 TRIGATEIN.GND | TRIGOUT.GND 39.47,14.71 52.96,14.71 TRIGOUT2.GND 53.11,14.78 v55.24,16.92 | v75.97,27.89 77.04,26.82 80.85,26.82 | 80.85,26.82 81.46,26.82 82.53,27.89 BUT1.4 | POWER.5 83.82,46.94 82.6,45.72 BUT.4 | BUT1.3 82.53,22.86 82.53,23.01 80.85,24.69 80.85,26.67 80.85,26.82 | POWER.4 81.23,63.55 78.87,65.91 68.05,65.91 66.9,64.77 66.06,64.77 ISP1.6 65.91,64.85 65.53,65.23 50.9,65.23 45.95,60.27 45.95,60.12 TRIGATEIN.GND
LTRIG
  Top 0.152: 50.37,42.67 50.37,43.74 44.81,49.3 44.5,49.3 T1.C | 50.37,42.67 50.37,41.91 R7.1 | 50.37,42.67 56.08,42.67 57.61,41.15 60.66,41.15 U1.32
MISO
  Top 0.152: U1.16 66.29,34.44 60.58,40.16 48.23,40.16 46.94,41.45 46.94,44.04 44.27,46.71 44.27,48.01 41.53,50.75 41.53,54.25 46.18,58.9 51.82,58.9 57.99,65.08 57.99,65.3 58.83,66.14 68.73,66.14 69.65,65.23 69.65,60.81 68.58,59.74 ISP1.1
MOSI  (via drill 0.35)
  Top 0.152: v65.53,34.29 65.53,32.54 U1.15 | v65.68,38.02 65.68,39.85 v65.76,39.93 | v45.11,54.56 50.14,54.56 v53.11,57.53
  Bottom 0.152: v65.53,34.29 65.53,37.87 v65.68,38.02 | 65.76,57.61 65.76,58.45 65,59.21 65,61.19 65.99,62.18 ISP1.4 | 65.76,57.61 v65.76,39.93 | v45.11,54.56 32.61,42.06 10.06,42.06 9.07,41.07 9.07,37.64 10.13,36.58 10.13,35.59 JP1.4 | v53.11,57.53 54.03,57.53 54.33,57.84 57.15,57.84 57.38,57.61 65.76,57.61
N$1
  Top 0.152: Q1.2 60.12,25.22 60.12,27.89 C1.1 60.12,27.96 60.12,34.37 59.66,34.82 U1.7
N$2
  Top 0.152: C2.1 71.55,27.89 71.55,23.39 72.08,22.86 Q1.1 71.55,23.32 69.88,21.64 59.74,21.64 59.21,22.17 59.21,33.98 U1.8
N$3  (via drill 0.35)
  Top 0.152: v67.89,10.13 68.96,10.13 R21.1
  Bottom 0.152: v67.89,10.13 63.86,10.13 46.86,27.13 15.09,27.13 10.29,31.93 9.68,31.93 8.76,32.84 8.76,52.35 15.24,58.83 29.79,58.83 29.95,58.98 ENC1.+R
N$4
  Top 0.152: IC2.1 26.67,29.34 28.65,31.32 28.65,37.03 29.18,37.57 IC1.3
N$5
  Top 0.152: IC2.2 27.96,26.14 27.96,26.59 31.01,29.64 34.9,29.64 35.2,29.95 35.2,34.98 33.07,37.11 33.07,37.57 IC1.6
N$6  (via drill 0.35)
  Top 0.152: R2.1 58.9,55.93 59.59,56.62 61.19,56.62 61.34,56.46 61.34,55.24 61.19,55.09 60.88,55.09 59.13,53.34 58.9,53.34 R3.1 58.83,53.34 58.06,53.34 v57.68,52.96 | v42.14,52.96 v46.63,52.96
  Bottom 0.152: v46.63,52.96 v57.68,52.96 | v42.14,52.96 27.05,52.96 22.55,57.45 15.54,57.45 ENC1.A
N$9
  Top 0.152: D1.A 80.01,49.76 80.01,51.51 88.85,60.35 88.85,60.96 POWER.9 88.92,60.96 88.92,63.48 POWER.10
N$10
  Top 0.152: D2.C 69.88,54.48 72.24,54.48 78.72,60.96 POWER.1 78.79,60.96 78.79,63.48 POWER.2
N$12  (via drill 0.35)
  Top 0.152: v57.68,58.22 57.84,58.37 58.83,58.37 R4.1 | v57.68,63.63 58.83,64.77 R1.1 | v50.37,63.63 30.94,63.63 30.4,64.16 25.98,64.16 24.31,62.48 15.54,62.48 ENC1.B
  Bottom 0.152: v57.68,58.22 v57.68,63.63 v50.37,63.63
N$15
  Top 0.152: R13.2 18.67,49.53 21.95,49.53 R8.1 22.02,49.53 24.38,47.17 43.43,47.17 T1.B
N$18
  Top 0.152: R8.2 23.77,49.53 32,49.53 32.77,48.77 35.81,48.77 35.97,48.92 35.97,58.45 34.44,59.97 TRIGATEIN.TIP
N$19
  Top 0.152: 39.47,35.51 39.47,36.35 IC3.7 | 39.47,35.51 39.47,25.15 38.56,24.23 38.56,22.86 R30.1 | 39.47,35.51 42.9,35.51 44.2,36.8 48.46,36.8 C14.2
N$21
  Top 0.152: R32.1 81.69,32.99 81.69,29.79 80.01,28.12 BUT1.K
N$22  (via drill 0.35)
  Top 0.152: R30.2 40.23,22.86 40.23,30.18 40.69,30.63 40.69,32.84 40.92,33.07 42.9,33.07 49.91,26.06 49.91,22.86 R34.2 49.99,22.86 v51.05,21.79 | v56.77,5.71 60.05,2.44 71.63,2.44 77.27,8.08 85.19,8.08 86.72,6.55 90.14,6.55 D4.A
  Bottom 0.152: v56.77,5.71 56.77,16.76 51.74,21.79 v51.05,21.79
N$23
  Top 0.152: D4.C 90.22,11.2 90.22,9.37 91.67,7.92 91.67,5.11 87.78,1.22 54.94,1.22 53.03,3.12 TRIGOUT2.TIP
N$24
  Top 0.152: R35.2 55.02,19.05 55.02,19.51 51.66,22.86 R34.1 51.59,22.86 51.59,28.88 50.6,29.87 50.6,36.8 C14.1 50.52,36.88 50.29,36.88 49.3,37.87 43.51,37.87 42.6,36.96 IC3.5
N$27  (via drill 0.35)
  Top 0.152: 54.67,14.52 54.63,14.55 54.63,17.22 55.93,18.52 55.93,19.66 56.08,19.81 58.06,19.81 62.64,15.24 R11.1 | 54.67,14.52 62.64,6.55 62.64,6.4 R10.1 | v53.49,13.34 54.63,14.48 54.67,14.52
  Bottom 0.152: v53.49,13.34 30.02,13.34 28.65,11.96 15.16,11.96 14.33,11.12 14.33,7.77 15.47,6.63 15.47,5.71 ENC2.A
N$28  (via drill 0.35)
  Top 0.152: R12.1 69.04,12.72 70.56,14.25 73.38,14.25 73.69,13.95 73.69,5.41 71.32,3.05 70.03,3.05 69.27,3.81 69.04,3.81 R6.1 68.96,3.81 67.89,4.88 v61.8,4.88
  Bottom 0.152: v61.8,4.88 40.01,4.88 32.54,12.34 29.49,12.34 27.89,10.74 15.54,10.74 ENC2.B
N$30
  Top 0.152: R27.1 33.38,49.53 33.38,57.61 30.02,60.96 ENC1.+G
N$31  (via drill 0.35)
  Top 0.152: v73.08,44.73 71.55,43.2 R15.1
  Bottom 0.152: v73.08,44.73 78.87,44.73 BUT.K
N$32
  Top 0.152: 47.55,20.42 50.22,20.42 51.59,19.05 R16.1 | 47.55,20.42 46.33,20.42 43.89,22.86 43.66,22.86 R17.2 43.59,22.86 41.3,25.15 41.3,31.62 IC3.3 | 47.55,20.42 47.55,19.51 46.02,17.98 41.83,17.98 40.01,19.81 35.28,19.81 32.23,22.86 32.08,22.86 C6.1
N$33
  Top 0.152: 37.72,22.1 34.82,22.1 34.06,22.86 C6.2 | 37.72,22.1 38.18,22.1 41.99,18.29 44.27,18.29 45.03,19.05 45.26,19.05 R18.1 | 37.72,22.1 37.72,23.85 38.71,24.84 38.71,31.62 IC3.1
N$34  (via drill 0.35)
  Top 0.152: v46.94,19.81 44.65,19.81 43.89,19.05 43.66,19.05 R18.2 | v48.84,19.81 49.15,19.81 49.91,19.05 R16.2 | v55.85,5.71 59.44,2.13 71.78,2.13 76.12,6.48 83.82,6.48 D3.A
  Bottom 0.152: v46.94,19.81 v48.84,19.81 53.26,19.81 55.85,17.22 v55.85,5.71
N$35
  Top 0.152: R38.1 62.64,3.81 60.05,3.81 55.85,8 31.17,8 30.02,9.14 ENC2.+G
N$36  (via drill 0.35)
  Top 0.152: v62.64,7.47 62.64,10.13 R31.1
  Bottom 0.152: v62.64,7.47 62.64,4.72 61.87,3.96 53.8,3.96 53.49,4.27 32.92,4.27 30.02,7.16 ENC2.+R
N$38  (via drill 0.35)
  Top 0.35: v71.93,47.62 69.88,49.68 D2.A | v86.56,29.34 87.94,27.96 C5.-
  Bottom 0.35: v71.93,47.62 71.93,38.71 81.31,29.34 v86.56,29.34
N$74
  Top 0.152: D3.C 83.82,11.2 79.93,11.2 71.48,2.74 60.66,2.74 57.07,6.33 42.6,6.33 39.47,3.2 TRIGOUT.TIP
RST
  Top 0.152: ISP1.5 67.51,63.7 67.51,59.66 63.17,55.32 63.17,41.15 U1.29
RST-DISP  (via drill 0.35)
  Top 0.152: v63.86,49.38 63.86,41.15 U1.28 | v62.56,50.67 61.8,50.67 56.54,45.41 49.99,45.41 44.65,50.75 v42.44,50.75
  Bottom 0.152: v62.56,50.67 v63.86,49.38 | v42.44,50.75 41.76,50.75 30.79,39.78 21.11,39.78 14.4,33.07 10.21,33.07 JP1.5
SCK  (via drill 0.35)
  Top 0.152: v70.33,39.93 70.33,36.12 68.28,34.06 67.82,34.06 U1.17 | v56.46,64.47 25.83,64.47 25.07,63.7 15.09,63.7 9.07,57.68 9.07,40.16 10.13,39.09 10.13,38.1 JP1.3
  Bottom 0.152: v70.33,39.93 70.33,60.43 68.58,62.18 ISP1.3 68.58,62.26 67.51,63.32 65.99,63.32 64.85,64.47 v56.46,64.47
TRIG1
  Top 0.152: R33.2 80.85,19.05 80.85,21.79 80.01,22.63 BUT1.A 79.36,23.36 | 79.36,23.36 79.02,23.7 79.02,27.81 74.14,32.69 71.93,32.69 70.87,31.62 64.31,31.62 63.93,32 63.93,32.54 U1.13 | IC3.6 41.3,36.96 41.3,37.41 42.14,38.25 50.9,38.25 51.59,37.57 51.59,29.34 59.59,21.34 77.34,21.34 79.32,23.32 79.36,23.36
TRIGO  (via drill 0.35)
  Top 0.152: v77.95,38.18 76.66,36.88 R19.2 76.58,36.8 73.38,33.6 v72.47,33.6 | v72.24,32.08 71.48,31.32 63.86,31.32 63.17,32 63.17,32.54 U1.12 63.09,32.99 v62.33,33.76 | v41.15,33.76 40.01,32.61 IC3.2
  Bottom 0.152: v77.95,38.18 77.95,38.41 80.01,40.46 BUT.A | v72.24,32.08 72.24,33.38 v72.47,33.6 | v62.33,33.76 v41.15,33.76

### Text on the board
bNames: Mineral Fire | V0.4 / SMD / OLED | Designed by Andy C / Hardware inspired by GMSN! ADSR / Display based on SparkFun / OpenSegment Serial Display | From the Workshop of Telescopes | CS-Disp | @R2Project / 2018